# Altium schematic sheet 5_SDRAM.SchDoc: AX301  Http://www.heijin.org
size OrCAD A; DocumentNumber: 5; SheetNumber: 5; SheetTotal: 7; PageSetup: Record=PageOptions|CenterHorizontal=True|CenterVertical=True|PrintScale=1.03|XCorrection=1.00|YCorrection=1.00|PrintKind=0|BorderSize=5000000|LeftOffset=0|BottomOffset=0|Orientation=2|PaperLength=1000|PaperWidth=1000|Scale=100|PaperSource=7|PrintQuality=-4|MediaType=1|DitherType=10|PrintScaleMode=1|PaperKind=A4|PaperIndex=9
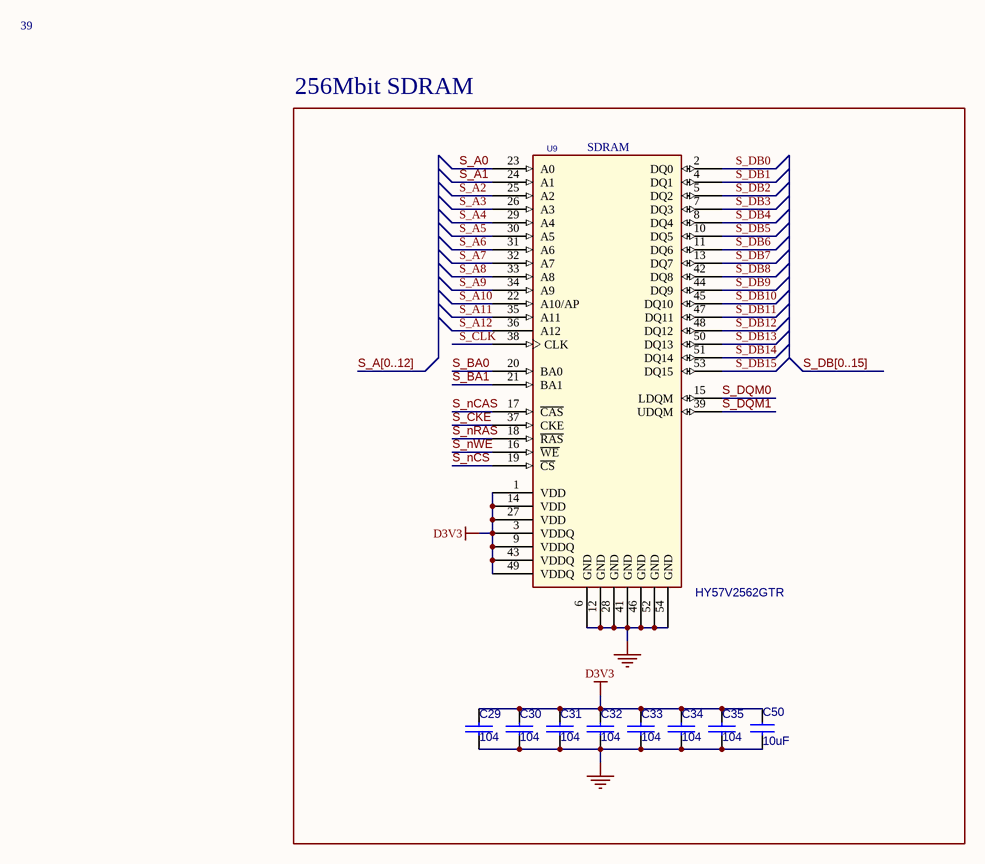
[diagram p0: 5_SDRAM.SchDoc]

## Parts
C29  104  [0402]
C30  104  [0402]
C31  104  [0402]
C32  104  [0402]
C33  104  [0402]
C34  104  [0402]
C35  104  [0402]
C50  10uF  [0805]
U9  HY57V2562GTR  [TSOP-54]

## Nets
D3V3: C29.1 C30.1 C31.1 C32.1 C33.1 C34.1 C35.1 C50.1 U9.1(VDD) U9.3(VDDQ) U9.9(VDDQ) U9.14(VDD) U9.27(VDD) U9.43(VDDQ) U9.49(VDDQ)
GND: C29.2 C30.2 C31.2 C32.2 C33.2 C34.2 C35.2 C50.2 U9.6(GND) U9.12(GND) U9.28(GND) U9.41(GND) U9.46(GND) U9.52(GND) U9.54(GND)
S_A0: U9.23(A0)
S_A1: U9.24(A1)
S_A2: U9.25(A2)
S_A3: U9.26(A3)
S_A4: U9.29(A4)
S_A5: U9.30(A5)
S_A6: U9.31(A6)
S_A7: U9.32(A7)
S_A8: U9.33(A8)
S_A9: U9.34(A9)
S_A10: U9.22(A10/AP)
S_A11: U9.35(A11)
S_A12: U9.36(A12)
S_BA0: U9.20(BA0)
S_BA1: U9.21(BA1)
S_CKE: U9.37(CKE)
S_CLK: U9.38(CLK)
S_DB0: U9.2(DQ0)
S_DB1: U9.4(DQ1)
S_DB2: U9.5(DQ2)
S_DB3: U9.7(DQ3)
S_DB4: U9.8(DQ4)
S_DB5: U9.10(DQ5)
S_DB6: U9.11(DQ6)
S_DB7: U9.13(DQ7)
S_DB8: U9.42(DQ8)
S_DB9: U9.44(DQ9)
S_DB10: U9.45(DQ10)
S_DB11: U9.47(DQ11)
S_DB12: U9.48(DQ12)
S_DB13: U9.50(DQ13)
S_DB14: U9.51(DQ14)
S_DB15: U9.53(DQ15)
S_DQM0: U9.15(LDQM)
S_DQM1: U9.39(UDQM)
S_nCAS: U9.17(~{CAS})
S_nCS: U9.19(~{CS})
S_nRAS: U9.18(~{RAS})
S_nWE: U9.16(~{WE})

## Buses and harness runs
bus S_A[0..12]
bus S_DB[0..15]

## Notes on the sheet
- 39
- 256Mbit SDRAM
- (near U9) SDRAM
- Title
- Size:
- Date:
- Orcad A
- Number:
- Time:
- Revision:
- Sheet
- of
- File:

## Library data of the parts
C29-C35 = C_Dup2
C50 = CAP NP_Dup2
U9 = HY57651620/SO_0